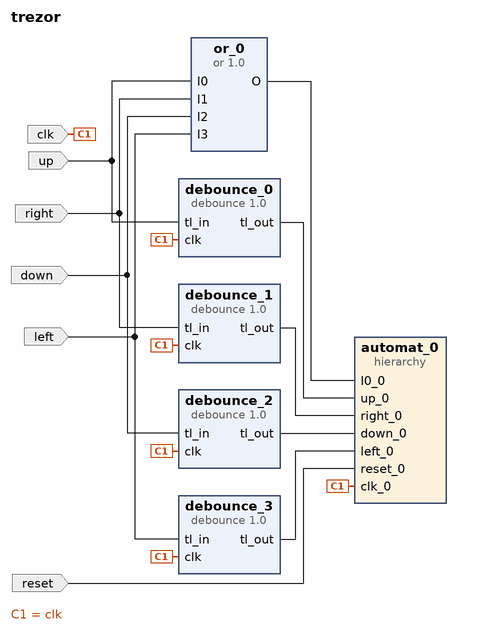
[diagram p0: block diagram of the top level]
# Vivado block design trezor, xc7a200tfbg676-2, Vivado 2018.2
create_bd_design trezor

create_bd_port -dir I clk
create_bd_port -dir I reset
create_bd_port -dir I up
create_bd_port -dir I right
create_bd_port -dir I down
create_bd_port -dir I left

create_bd_cell -type hier automat_0
create_bd_cell -type ip -vlnv FIT:user:debounce:1.0 debounce_0
create_bd_cell -type ip -vlnv FIT:user:debounce:1.0 debounce_1
create_bd_cell -type ip -vlnv FIT:user:debounce:1.0 debounce_2
create_bd_cell -type ip -vlnv FIT:user:debounce:1.0 debounce_3
create_bd_cell -type ip -vlnv FIT:user:or:1.0 or_0
set_property -dict {CONFIG.Inputs 4} [get_bd_cells or_0]

# ---- hierarchy /automat_0 ----
current_bd_instance /automat_0
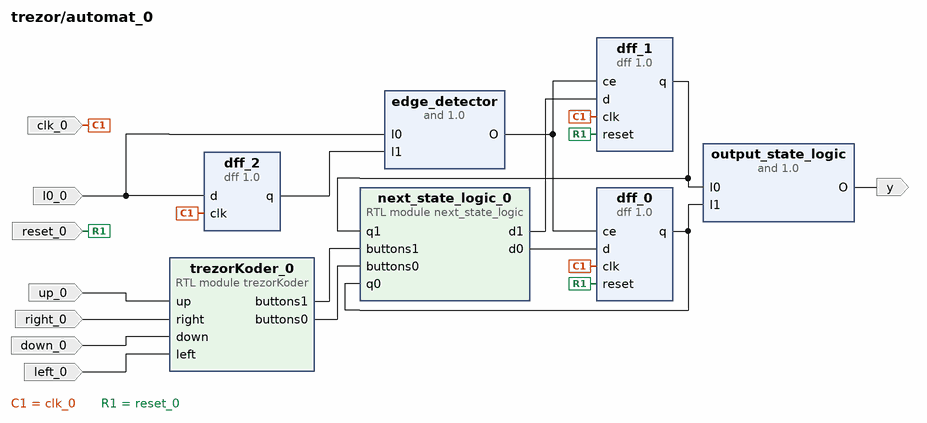
[diagram p1: block diagram inside /automat_0]
create_bd_pin -dir O -type data y
create_bd_pin -dir I up_0
create_bd_pin -dir I right_0
create_bd_pin -dir I down_0
create_bd_pin -dir I left_0
create_bd_pin -dir I clk_0
create_bd_pin -dir I reset_0
create_bd_pin -dir I -type data I0_0

create_bd_cell -type ip -vlnv FIT:user:and:1.0 output_state_logic
create_bd_cell -type module -reference trezorKoder trezorKoder_0
create_bd_cell -type ip -vlnv FIT:user:dff:1.0 dff_0
create_bd_cell -type module -reference next_state_logic next_state_logic_0
create_bd_cell -type ip -vlnv FIT:user:dff:1.0 dff_1
create_bd_cell -type ip -vlnv FIT:user:and:1.0 edge_detector
set_property -dict {CONFIG.I1_inverted true} [get_bd_cells edge_detector]
create_bd_cell -type ip -vlnv FIT:user:dff:1.0 dff_2
set_property -dict {CONFIG.CE false CONFIG.Reset false} [get_bd_cells dff_2]

# ---- connections ----

current_bd_instance /automat_0
connect_bd_net [get_bd_pins dff_1/q] [get_bd_pins next_state_logic_0/q1] [get_bd_pins output_state_logic/I0]
connect_bd_net [get_bd_pins dff_0/q] [get_bd_pins next_state_logic_0/q0] [get_bd_pins output_state_logic/I1]
connect_bd_net [get_bd_pins trezorKoder_0/buttons1] [get_bd_pins next_state_logic_0/buttons1]
connect_bd_net [get_bd_pins trezorKoder_0/buttons0] [get_bd_pins next_state_logic_0/buttons0]
connect_bd_net [get_bd_pins next_state_logic_0/d0] [get_bd_pins dff_0/d]
connect_bd_net [get_bd_pins next_state_logic_0/d1] [get_bd_pins dff_1/d]
connect_bd_net [get_bd_pins output_state_logic/O] [get_bd_pins y]
connect_bd_net -net up_0_1 [get_bd_pins up_0] [get_bd_pins trezorKoder_0/up]
connect_bd_net -net right_0_1 [get_bd_pins right_0] [get_bd_pins trezorKoder_0/right]
connect_bd_net -net down_0_1 [get_bd_pins down_0] [get_bd_pins trezorKoder_0/down]
connect_bd_net -net left_0_1 [get_bd_pins left_0] [get_bd_pins trezorKoder_0/left]
connect_bd_net -net clk_0_1 [get_bd_pins clk_0] [get_bd_pins dff_1/clk] [get_bd_pins dff_0/clk] [get_bd_pins dff_2/clk]
connect_bd_net -net reset_0_1 [get_bd_pins reset_0] [get_bd_pins dff_1/reset] [get_bd_pins dff_0/reset]
connect_bd_net [get_bd_pins edge_detector/O] [get_bd_pins dff_1/ce] [get_bd_pins dff_0/ce]
connect_bd_net [get_bd_pins dff_2/q] [get_bd_pins edge_detector/I1]
connect_bd_net -net I0_0_1 [get_bd_pins I0_0] [get_bd_pins edge_detector/I0] [get_bd_pins dff_2/d]

current_bd_instance /
connect_bd_net -net clk_0_1 [get_bd_ports clk] \
  [get_bd_pins automat_0/clk_0] [get_bd_pins debounce_0/clk] [get_bd_pins debounce_1/clk] [get_bd_pins debounce_2/clk] \
  [get_bd_pins debounce_3/clk]
connect_bd_net -net reset_0_1 [get_bd_ports reset] [get_bd_pins automat_0/reset_0]
connect_bd_net -net up_0_1 [get_bd_pins debounce_0/tl_out] [get_bd_pins automat_0/up_0]
connect_bd_net -net right_0_1 [get_bd_pins debounce_1/tl_out] [get_bd_pins automat_0/right_0]
connect_bd_net -net down_0_1 [get_bd_pins debounce_2/tl_out] [get_bd_pins automat_0/down_0]
connect_bd_net -net left_0_1 [get_bd_pins debounce_3/tl_out] [get_bd_pins automat_0/left_0]
connect_bd_net -net tl_in_0_1 [get_bd_ports up] [get_bd_pins debounce_0/tl_in] [get_bd_pins or_0/I0]
connect_bd_net -net tl_in_0_2 [get_bd_ports right] [get_bd_pins debounce_1/tl_in] [get_bd_pins or_0/I1]
connect_bd_net -net tl_in_0_3 [get_bd_ports down] [get_bd_pins debounce_2/tl_in] [get_bd_pins or_0/I2]
connect_bd_net -net tl_in_0_4 [get_bd_ports left] [get_bd_pins debounce_3/tl_in] [get_bd_pins or_0/I3]
connect_bd_net -net I0_0_1 [get_bd_pins or_0/O] [get_bd_pins automat_0/I0_0]

validate_bd_design
save_bd_design
